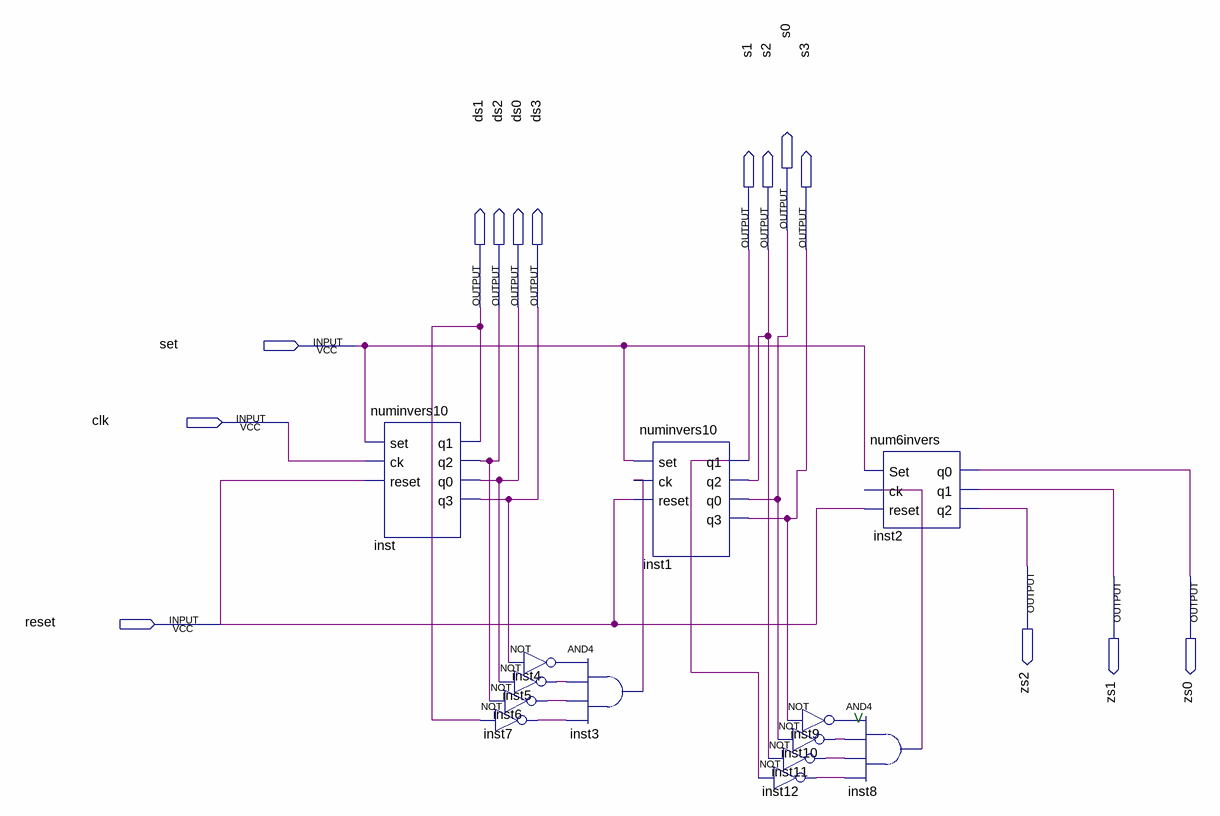
[diagram p0: schematic sheet]
// Quartus schematic numaratorsecunde.bdf as structural Verilog: 13 symbols, 14 pins
module numaratorsecunde (
  input  set,
  input  clk,
  input  reset,
  output s0,
  output s1,
  output s2,
  output s3,
  output ds1,
  output ds2,
  output ds0,
  output ds3,
  output zs2,
  output zs1,
  output zs0
);

  wire inst3_out, inst4_out, inst5_out, inst6_out, inst7_out, inst8_out, inst9_out, inst10_out, inst11_out,
       inst12_out;

  numinvers10 inst (.set(set), .ck(clk), .reset(reset), .q1(ds1), .q2(ds2), .q0(ds0), .q3(ds3));
  not inst4 (inst4_out, ds3);
  not inst5 (inst5_out, ds0);
  not inst6 (inst6_out, ds2);
  not inst7 (inst7_out, ds1);
  and inst3 (inst3_out, inst4_out, inst5_out, inst6_out, inst7_out);
  numinvers10 inst1 (.set(set), .ck(inst3_out), .reset(reset), .q1(s1), .q2(s2), .q0(s0), .q3(s3));
  not inst12 (inst12_out, s1);
  not inst9 (inst9_out, s3);
  not inst10 (inst10_out, s0);
  not inst11 (inst11_out, s2);
  num6invers inst2 (.Set(set), .ck(inst8_out), .reset(reset), .q0(zs0), .q1(zs1), .q2(zs2));
  and inst8 (inst8_out, inst9_out, inst10_out, inst11_out, inst12_out);

  // Notes on the sheet:
  //   V
endmodule
